# EAGLE design encoder (EAGLE 6.2)
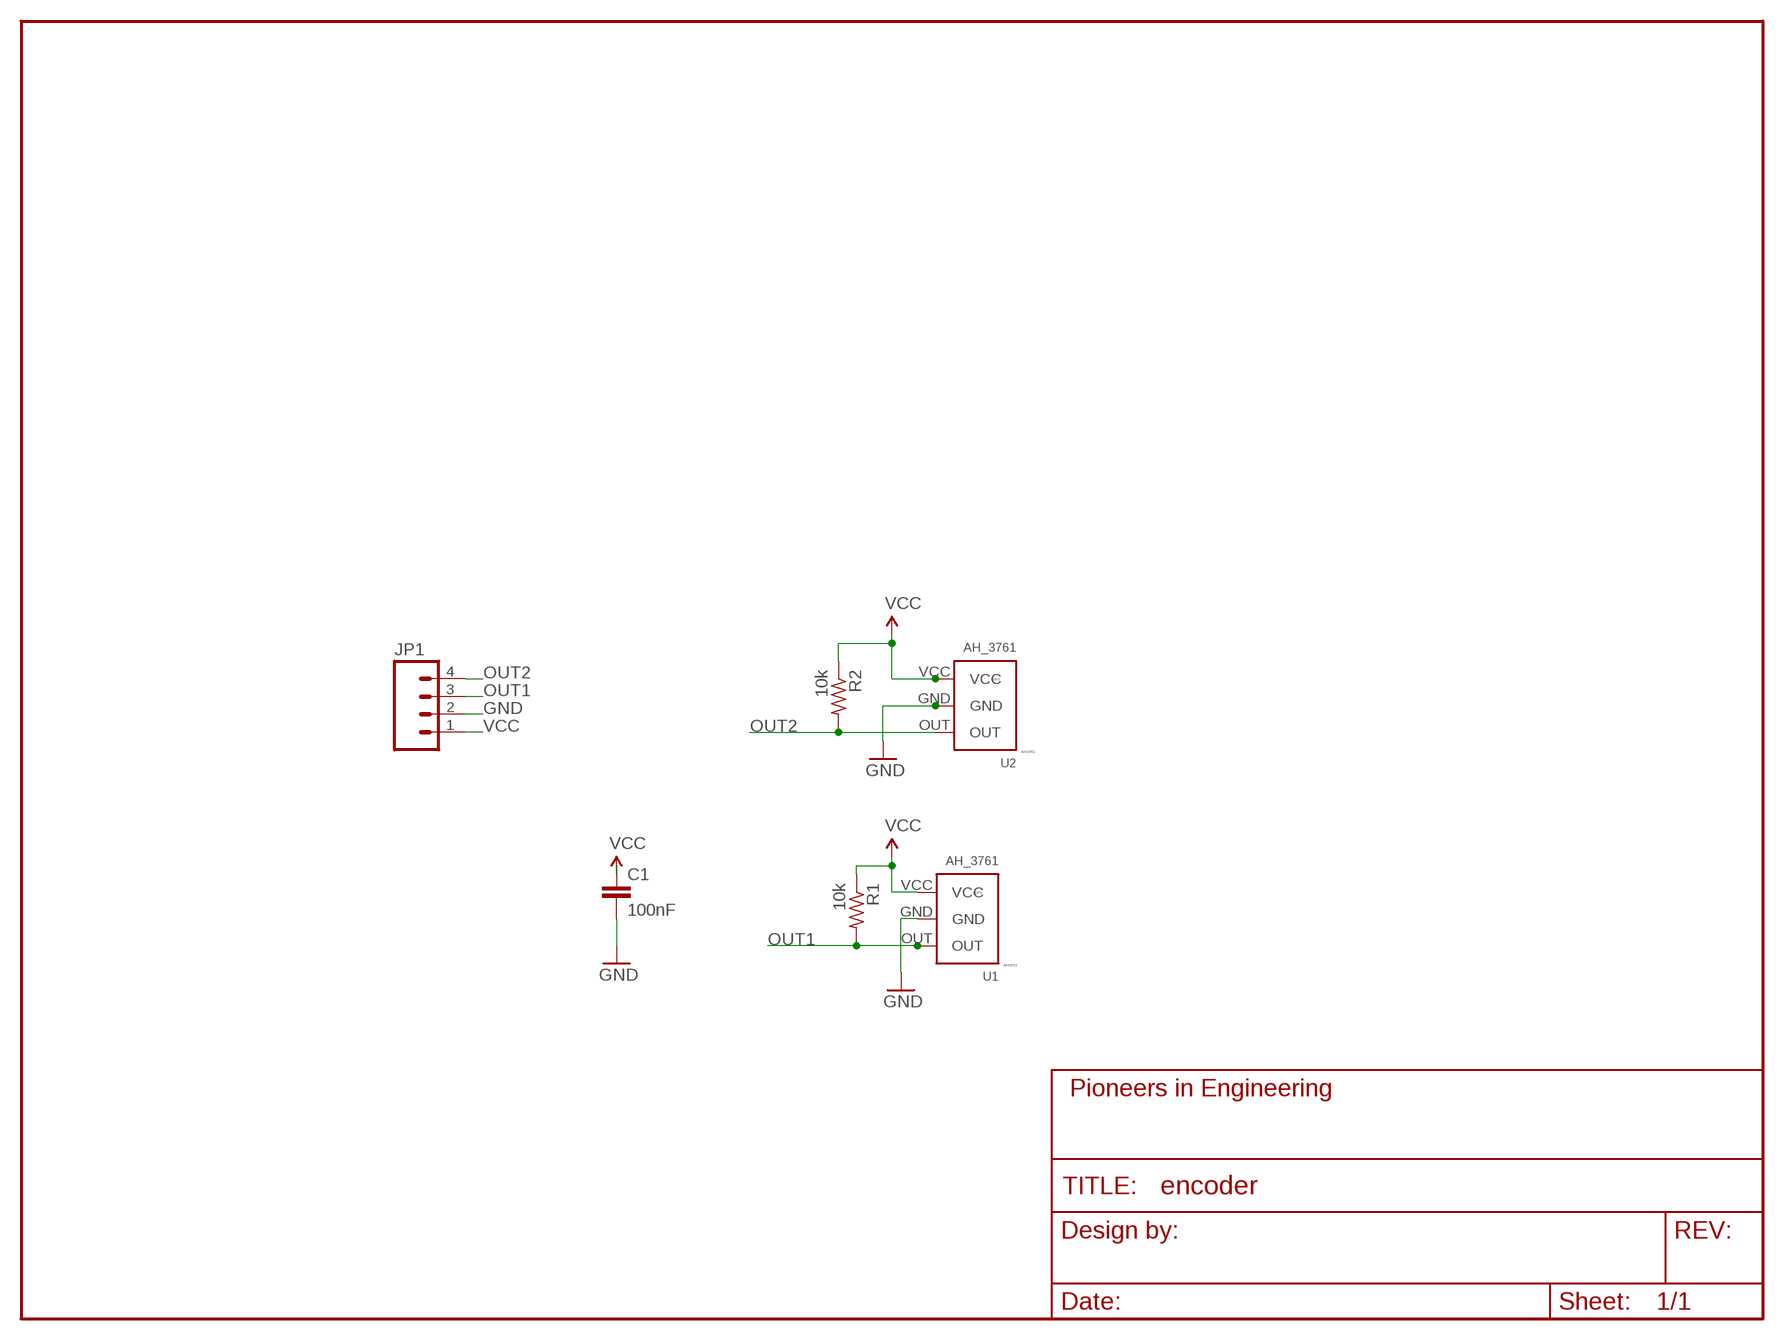
[diagram p0: schematic, sheet 1]
FRAME1 (FRAME-LETTER): AUTHOR: Chris Buonocore; REVISION: B

## Parts
C1  100nF  CAP0603-CAP  [0603-CAP]
JP1  M04POLAR  [MOLEX-1X4]
R1  10k  R-US_R0603  [R0603]
R2  10k  R-US_R0603  [R0603]
U1  AH_3761  [SIP3]
U2  AH_3761  [SIP3]

## Nets
GND: C1.2 JP1.2 U1.GND U2.GND
OUT1: JP1.3 R1.2 U1.OUT
OUT2: JP1.4 R2.2 U2.OUT
VCC: C1.1 JP1.1 R1.1 R2.1 U1.VCC U2.VCC

## Library data of the parts
C1 = pie:CAP: Capacitor Standard 0603 ceramic capacitor, and 0.1" leaded capacitor.
JP1 = pie:M04: Header 4 Standard 4-pin 0.1" header. Use with straight break away headers (SKU : PRT-00116), right angle break away headers (PRT-00553), swiss pins (PRT-00743), machine pins (PRT-00117), and female headers (PRT-00115). Molex polarized connector foot print use with SKU : PRT-08231 with associated crimp pins and housings. 1MM SMD Version SKU: PRT-10208
R1 R2 = pie:R-US_: RESISTOR, American symbol
U1 U2 = custom_hall:AH_3761

## Board
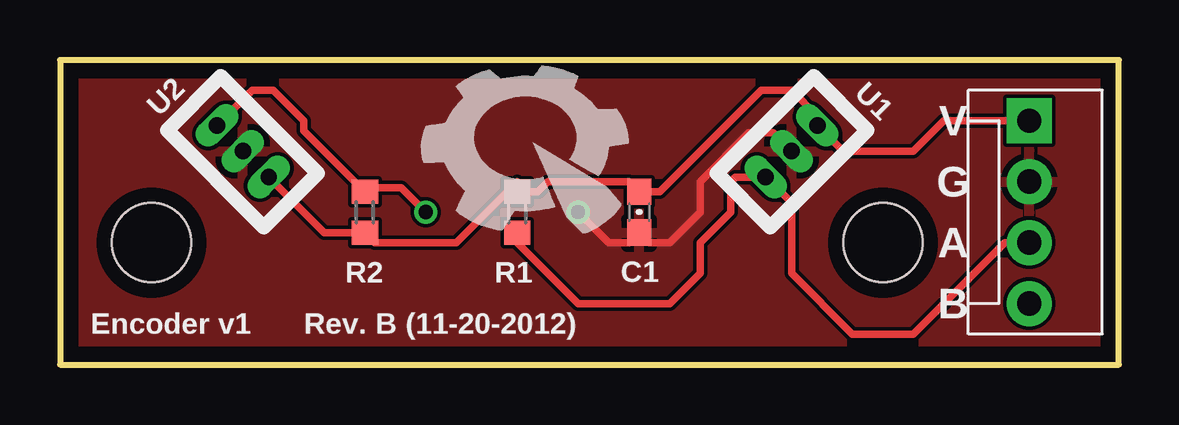
[diagram p1: board, top side]
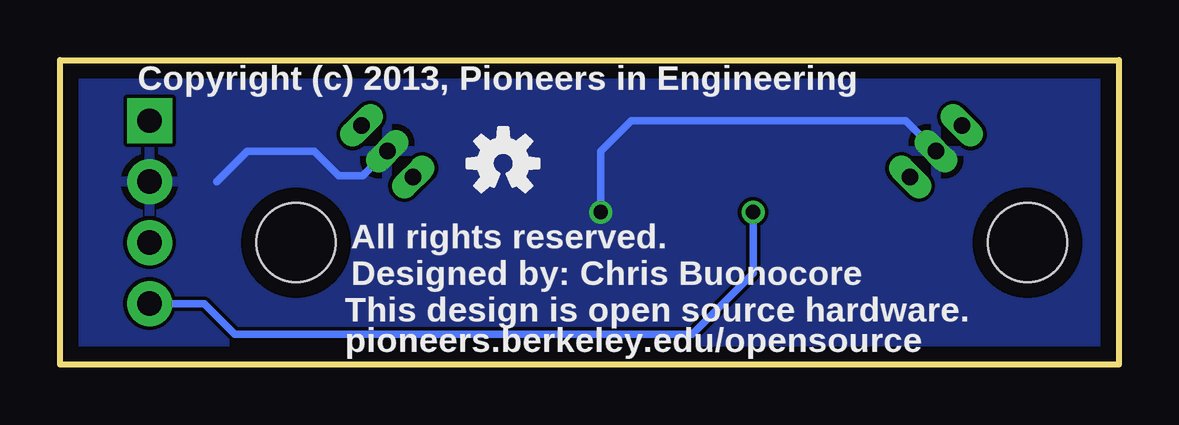
[diagram p2: board, bottom side, seen from below]

Size 44.12 x 12.69 mm. Coordinates in mm from the lower left corner, seen from the top.
Outline: 0,0 44.12,0 44.12,12.69 0,12.69 0,0
Copper layers (1*16): Top 2mil / dielectric 9mil / Bottom 2mil
Design rules "advancedcircuits-33each-pie": minimum track width 6mil, minimum drill 15mil, track to track 6mil, track to pad 10mil, pad to pad 6mil, via to via 6mil, smd to smd 6mil, copper to edge 25mil, drill to drill 7mil, minimum pad ring 7mil, minimum via ring 7mil, stop-mask expansion 3mil, vias tented up to drill 0mil, thermal gap 10mil

### Footprints (pad centres in the part's own frame; a part is rotated, then mirrored left to right if it is on the bottom)
0603-CAP = smd 1.1 x 1: 1 -0.85,0; 2 0.85,0
STAND-OFF = hole 3.302: 0,0
MOLEX-1X4 = drill 1.016 pad 1.88 square: 1 0,0 | drill 1.016 pad 1.88: 2 2.54,0; 3 5.08,0; 4 7.62,0
R0603 = smd 1 x 1.1: 1 -0.85,0; 2 0.85,0
SIP3 = drill 0.686 pad 0.813 long: GND 0,0; OUT 0,1.524; VCC 0,-1.524

### Placement (x,y rotation side)
C1  24.13,6.35 270 top
E$1  [STAND-OFF]  34.29,5.08 0 top
E$2  [STAND-OFF]  3.81,5.08 0 top
JP1  40.39,10.16 270 top
R1  19.05,6.35 270 top
R2  12.7,6.35 90 top
U1  30.48,8.89 135 top
U2  7.62,8.89 45 top
U$1  [PIE-LOGO-SMALL]  19.68,9.27 0 top
U$2  [OSHW-LOGO-S]  25.65,8.38 0 bottom

### Tracks (layer width: path | path; a pad name or v marks a point on that pad's centre or on a via)
GND  (via drill 0.6)
  Top 0.305: v21.59,6.35 22.86,5.08 23.71,5.08 C1.2 24.55,5.08 25.4,5.08 26.67,6.35 26.67,7.62 28.7,9.65 29.72,9.65 U1.GND
  Bottom 0.305: U2.GND 8.89,10.16 20.32,10.16 21.59,8.89 v21.59,6.35 | 37.59,7.62 36.32,8.89 33.53,8.89 32.51,7.87 31.5,7.87 U1.GND
  pour Bottom: 0,0 44.45,0 44.45,12.7 0,12.7
  pour Top: 0,12.7 44.45,12.7 44.45,0 0,0
OUT1
  Top 0.305: R1.2 19.05,5.08 21.59,2.54 25.4,2.54 26.67,3.81 26.67,5.08 27.94,6.35 27.94,7.62 28.13,7.81 U1.OUT 30.48,6.74 30.48,3.81 33.02,1.27 35.56,1.27 39.37,5.08 JP1.3
OUT2  (via drill 0.6)
  Top 0.305: v15.24,6.35 14.22,7.37 12.87,7.37 R2.2 10.16,9.74 10.16,10.16 8.89,11.43 8.01,11.43 U2.OUT
  Bottom 0.305: v15.24,6.35 15.24,3.81 17.78,1.27 36.83,1.27 38.1,2.54 JP1.4
VCC
  Top 0.305: U2.VCC 11.01,5.5 R2.1 13.12,5.08 16.51,5.08 19.05,7.62 R1.1 19.9,7.2 20.32,7.62 23.71,7.62 C1.1 24.98,7.2 29.21,11.43 30.48,11.43 31.56,10.35 U1.VCC 32.63,8.89 35.56,8.89 36.83,10.16 JP1.1

### Text on the board
tPlace: V | G | A | B | Encoder v1 | Rev. B (11-20-2012)
bPlace: Copyright (c) 2013, Pioneers in Engineering | All rights reserved. | Designed by: Chris Buonocore | This design is open source hardware. | pioneers.berkeley.edu/opensource